# Altium schematic sheet INA169.SchDoc
size A4
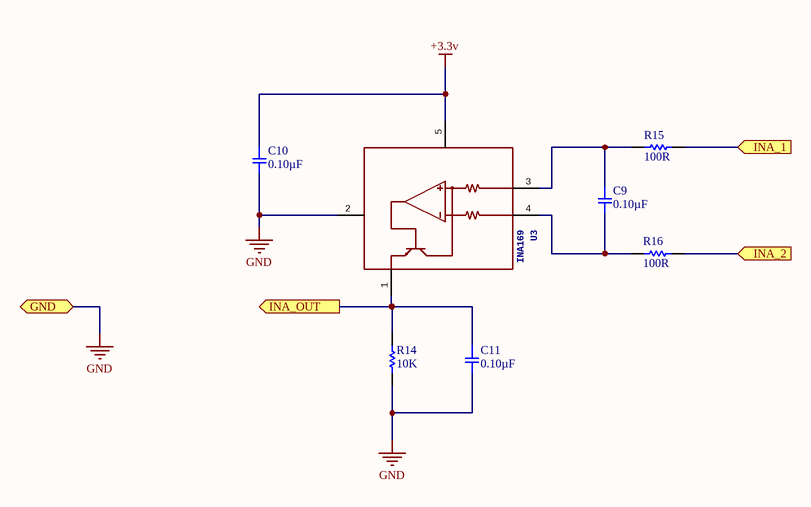
[diagram p0: INA169.SchDoc]

## Parts
C9  0.10µF  [SMD-0603C]
C10  0.10µF  [SMD-0603C]
C11  0.10µF  [SMD-0603C]
R14  value 10K  [SMD-0603-RES]  (hidden comment: RC0402JR-071KL)
R15  value 100R  [SMD-0603-RES]  (hidden comment: RC0402JR-071KL)
R16  value 100R  [SMD-0603-RES]  (hidden comment: RC0402JR-071KL)
U3  INA169  [SOT23-5]

## Ports
GND (bidir), INA_1 (in), INA_2 (in), INA_OUT (out)

## Nets
+3.3v: C10.1 U3.5(V+)
GND: C10.2 C11.2 R14.1 U3.2(GND) ; port GND
INA_1: R15.1 ; port INA_1
INA_2: R16.1 ; port INA_2
INA_OUT: C11.1 R14.2 U3.1(OUT) ; port INA_OUT
NetC9_1: C9.1 R15.2 U3.3(VIN+)
NetC9_2: C9.2 R16.2 U3.4(VIN-)

## Library data of the parts
C9-C11 = GCJ188R71C104KA01D: CAP CER 0.1UF 16V X7R 0603; Manufacturer: Murata Electronics North America; Factory Stock: 0; Unit Price (USD): 0.21; Minimum Quantity: 1; Tolerance: ±10%; Datasheets: http://www.murata.com/~/media/webrenewal/support/library/catalog/products/capacitor/mlcc/c03e.ashx; Image: //media.digikey.com/Renders/Murata%20Renders/0603%28LQG18%29.jpg; Digi-Key Part Number: 490-5796-1-ND; Part Number: GCJ188R71C104KA01D; Quantity Available: 22473; @ qty: 0; Packaging: Cut Tape (CT); Series: GCJ; Part Status: Active; Value: 0.10µF; Voltage: 16V; Temperature Coefficient: X7R; Operating Temperature: -55°C ~ 125°C; Features: Soft Termination; Ratings: AEC-Q200; Applications: Automotive, Boardflex Sensitive; Mounting Type: Surface Mount, MLCC; Package / Case: 0603 (1608 Metric); Size / Dimension: 0.063" L x 0.031" W (1.60mm x 0.80mm); Height - Seated (Max): -; Thickness (Max): 0.035" (0.90mm); Lead Spacing: -; Lead Style: -
R14-R16 = RES 1K 0402: RES SMD 10K OHM 5% 1/16W 0402
U3 = INA169: GateName_1: G$1; MF: Texas Instruments; SymbolName_1: INA169; LibraryName: INA169; DeviceSetName: INA169; Package: SOT23-5; Price: None; Availability: Unavailable; MP: INA169; Package: None